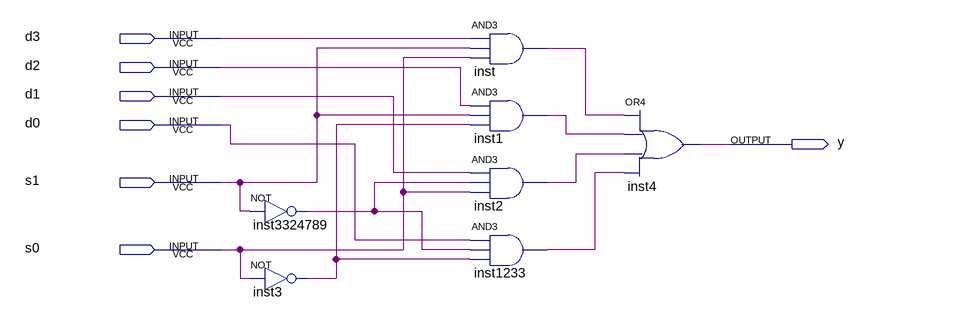
[diagram p0: schematic sheet]
// Quartus schematic mymux41.bdf as structural Verilog: 7 symbols, 7 pins
module mymux41 (
  input  d3,
  input  d2,
  input  d1,
  input  d0,
  input  s1,
  input  s0,
  output y
);

  wire inst1_out, inst2_out, inst3_out, inst1233_out, inst3324789_out, inst_out;

  not inst3324789 (inst3324789_out, s1);
  not inst3 (inst3_out, s0);
  and inst (inst_out, d3, s1, s0);
  and inst1 (inst1_out, d2, s1, inst3_out);
  and inst2 (inst2_out, d1, inst3324789_out, s0);
  and inst1233 (inst1233_out, d0, inst3324789_out, inst3_out);
  or inst4 (y, inst_out, inst1_out, inst2_out, inst1233_out);
endmodule
